# Altium project UmbilicalBoardV4.PrjPcb
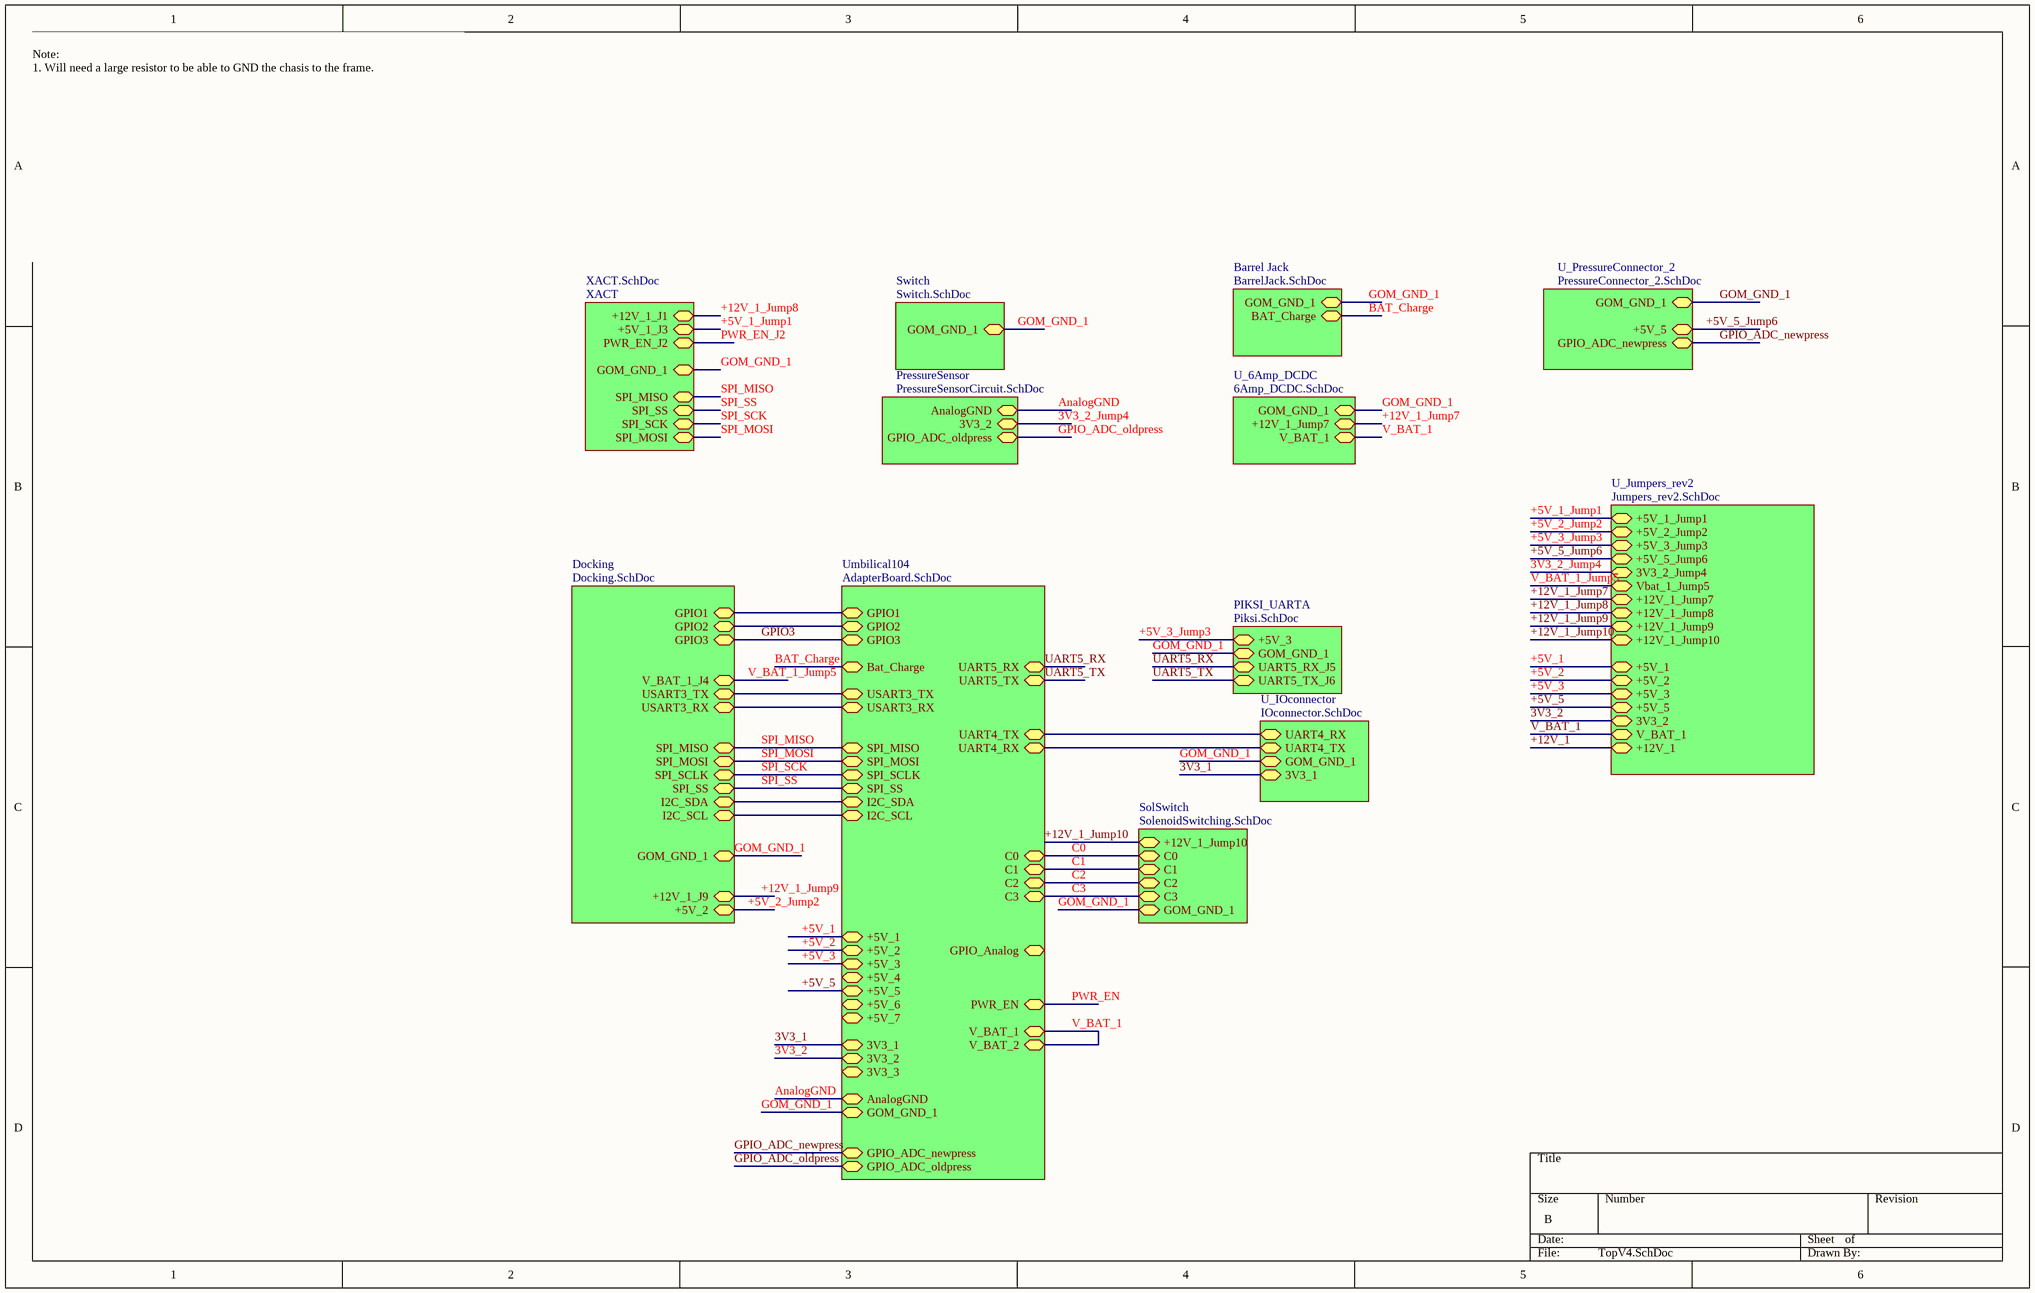
[diagram p0: TopV4.SchDoc]
2 sheets, 1 parts. Net scope: strictly hierarchical (ports join the sheet entries above them; power ports are local).
Board files: UmbilicalBoardV4.PcbDoc, 2016-05-17_12-43-15.PcbDoc
Sheets:
  TopV4.SchDoc
    PIKSI_UARTA = Piksi.SchDoc

## Sheet TopV4.SchDoc
size B; Organization: Cornell University; DocumentNumber: 1 of 11; SheetNumber: 1; SheetTotal: 11; DocumentName: Top Sheet; ProjectName: OAAN

### Sub-sheets
Barrel Jack = BarrelJack.SchDoc (file not in this document): GOM_GND_1 (bidir), BAT_Charge (bidir)
Docking = Docking.SchDoc (file not in this document): V_BAT_1_J4 (bidir), USART3_TX (bidir), SPI_SS (bidir), I2C_SDA (bidir), I2C_SCL (bidir), SPI_MOSI (bidir), SPI_SCLK (bidir), GPIO3 (bidir), +5V_2 (bidir), USART3_RX (bidir), SPI_MISO (bidir), GPIO2 (bidir), +12V_1_J9 (bidir), GPIO1 (bidir), GOM_GND_1 (bidir)
PIKSI_UARTA = Piksi.SchDoc: UART5_RX_J5 (bidir), UART5_TX_J6 (bidir), GOM_GND_1 (bidir), +5V_3 (bidir)
PressureSensor = PressureSensorCircuit.SchDoc (file not in this document): GPIO_ADC_oldpress (bidir), 3V3_2 (bidir), AnalogGND (bidir)
SolSwitch = SolenoidSwitching.SchDoc (file not in this document): C3 (bidir), C2 (bidir), +12V_1_Jump10 (bidir), C1 (bidir), C0 (bidir), GOM_GND_1 (bidir)
Switch = Switch.SchDoc (file not in this document): GOM_GND_1 (bidir)
U_6Amp_DCDC = 6Amp_DCDC.SchDoc (file not in this document): GOM_GND_1 (bidir), +12V_1_Jump7 (bidir), V_BAT_1 (bidir)
U_IOconnector = IOconnector.SchDoc (file not in this document): UART4_RX (bidir), UART4_TX (bidir), GOM_GND_1 (bidir), 3V3_1 (bidir)
U_Jumpers_rev2 = Jumpers_rev2.SchDoc (file not in this document): +5V_1_Jump1 (bidir), +5V_2_Jump2 (bidir), +5V_3_Jump3 (bidir), 3V3_2_Jump4 (bidir), Vbat_1_Jump5 (bidir), +5V_1 (bidir), +5V_2 (bidir), 3V3_2 (bidir), V_BAT_1 (bidir), +5V_3 (bidir), +5V_5_Jump6 (bidir), +5V_5 (bidir), +12V_1_Jump7 (bidir), +12V_1 (bidir), +12V_1_Jump9 (bidir), +12V_1_Jump8 (bidir), +12V_1_Jump10 (bidir)
U_PressureConnector_2 = PressureConnector_2.SchDoc (file not in this document): GOM_GND_1 (bidir), +5V_5 (bidir), GPIO_ADC_newpress (bidir)
Umbilical104 = AdapterBoard.SchDoc (file not in this document): C0 (bidir), 3V3_1 (bidir), USART3_TX (bidir), USART3_RX (bidir), GPIO3 (bidir), GPIO2 (bidir), GPIO1 (bidir), Bat_Charge (bidir), V_BAT_1 (bidir), I2C_SCL (bidir), SPI_MOSI (bidir), +5V_1 (bidir), I2C_SDA (bidir), SPI_MISO (bidir), SPI_SCLK (bidir), SPI_SS (bidir), UART5_RX (bidir), UART5_TX (bidir), UART4_TX (bidir), UART4_RX (bidir), C3 (bidir), C1 (bidir), C2 (bidir), +5V_3 (bidir), +5V_6 (bidir), +5V_5 (bidir), +5V_2 (bidir), 3V3_2 (bidir), +5V_4 (bidir), 3V3_3 (bidir), +5V_7 (bidir), GOM_GND_1 (bidir), AnalogGND (bidir), PWR_EN (bidir), V_BAT_2 (bidir), GPIO_ADC_newpress (bidir), GPIO_ADC_oldpress (bidir), GPIO_Analog (bidir)
XACT = XACT.SchDoc (file not in this document): +12V_1_J1 (bidir), +5V_1_J3 (bidir), SPI_SCK (bidir), SPI_SS (bidir), GOM_GND_1 (bidir), SPI_MOSI (bidir), SPI_MISO (bidir), PWR_EN_J2 (bidir)

### Nets
3V3_1: sheet Umbilical104/3V3_1, sheet U_IOconnector/3V3_1
3V3_2: sheet Umbilical104/3V3_2, sheet U_Jumpers_rev2/3V3_2
3V3_2_Jump4: sheet PressureSensor/3V3_2, sheet U_Jumpers_rev2/3V3_2_Jump4
+5V_1: sheet Umbilical104/+5V_1, sheet U_Jumpers_rev2/+5V_1
+5V_1_Jump1: sheet XACT/+5V_1_J3, sheet U_Jumpers_rev2/+5V_1_Jump1
+5V_2: sheet Umbilical104/+5V_2, sheet U_Jumpers_rev2/+5V_2
+5V_2_Jump2: sheet Docking/+5V_2, sheet U_Jumpers_rev2/+5V_2_Jump2
+5V_3: sheet Umbilical104/+5V_3, sheet U_Jumpers_rev2/+5V_3
+5V_3_Jump3: sheet PIKSI_UARTA/+5V_3, sheet U_Jumpers_rev2/+5V_3_Jump3
+5V_5: sheet Umbilical104/+5V_5, sheet U_Jumpers_rev2/+5V_5
+5V_5_Jump6: sheet U_Jumpers_rev2/+5V_5_Jump6, sheet U_PressureConnector_2/+5V_5
+12V_1: sheet U_Jumpers_rev2/+12V_1
+12V_1_Jump7: sheet U_6Amp_DCDC/+12V_1_Jump7, sheet U_Jumpers_rev2/+12V_1_Jump7
+12V_1_Jump8: sheet XACT/+12V_1_J1, sheet U_Jumpers_rev2/+12V_1_Jump8
+12V_1_Jump9: sheet Docking/+12V_1_J9, sheet U_Jumpers_rev2/+12V_1_Jump9
+12V_1_Jump10: sheet SolSwitch/+12V_1_Jump10, sheet U_Jumpers_rev2/+12V_1_Jump10
AnalogGND: sheet Umbilical104/AnalogGND, sheet PressureSensor/AnalogGND
BAT_Charge: sheet Umbilical104/Bat_Charge, sheet Barrel Jack/BAT_Charge
C0: sheet SolSwitch/C0, sheet Umbilical104/C0
C1: sheet SolSwitch/C1, sheet Umbilical104/C1
C2: sheet SolSwitch/C2, sheet Umbilical104/C2
C3: sheet SolSwitch/C3, sheet Umbilical104/C3
GOM_GND_1: sheet SolSwitch/GOM_GND_1, sheet Umbilical104/GOM_GND_1, sheet Switch/GOM_GND_1, sheet Docking/GOM_GND_1, sheet XACT/GOM_GND_1, sheet PIKSI_UARTA/GOM_GND_1, sheet Barrel Jack/GOM_GND_1, sheet U_6Amp_DCDC/GOM_GND_1, sheet U_IOconnector/GOM_GND_1, sheet U_PressureConnector_2/GOM_GND_1
GPIO3: sheet Umbilical104/GPIO3, sheet Docking/GPIO3
GPIO_ADC_newpress: sheet Umbilical104/GPIO_ADC_newpress, sheet U_PressureConnector_2/GPIO_ADC_newpress
GPIO_ADC_oldpress: sheet Umbilical104/GPIO_ADC_oldpress, sheet PressureSensor/GPIO_ADC_oldpress
PWR_EN: sheet Umbilical104/PWR_EN
PWR_EN_J2: sheet XACT/PWR_EN_J2
SPI_MISO: sheet Umbilical104/SPI_MISO, sheet Docking/SPI_MISO, sheet XACT/SPI_MISO
SPI_MOSI: sheet Umbilical104/SPI_MOSI, sheet Docking/SPI_MOSI, sheet XACT/SPI_MOSI
SPI_SCK: sheet Umbilical104/SPI_SCLK, sheet Docking/SPI_SCLK, sheet XACT/SPI_SCK
SPI_SS: sheet Umbilical104/SPI_SS, sheet Docking/SPI_SS, sheet XACT/SPI_SS
UART5_RX: sheet Umbilical104/UART5_RX, sheet PIKSI_UARTA/UART5_RX_J5
UART5_TX: sheet Umbilical104/UART5_TX, sheet PIKSI_UARTA/UART5_TX_J6
V_BAT_1: sheet Umbilical104/V_BAT_1, sheet Umbilical104/V_BAT_2, sheet U_6Amp_DCDC/V_BAT_1, sheet U_Jumpers_rev2/V_BAT_1
V_BAT_1_Jump5: sheet Docking/V_BAT_1_J4, sheet U_Jumpers_rev2/Vbat_1_Jump5
(unnamed): sheet Umbilical104/USART3_TX, sheet Docking/USART3_TX
(unnamed): sheet Umbilical104/USART3_RX, sheet Docking/USART3_RX
(unnamed): sheet Umbilical104/GPIO2, sheet Docking/GPIO2
(unnamed): sheet Umbilical104/GPIO1, sheet Docking/GPIO1
(unnamed): sheet Umbilical104/I2C_SCL, sheet Docking/I2C_SCL
(unnamed): sheet Umbilical104/I2C_SDA, sheet Docking/I2C_SDA
(unnamed): sheet Umbilical104/UART4_TX, sheet U_IOconnector/UART4_RX
(unnamed): sheet Umbilical104/UART4_RX, sheet U_IOconnector/UART4_TX

### Notes on the sheet
- Note:
  1. Will need a large resistor to be able to GND the chasis to the frame.

## Sheet Piksi.SchDoc
size B
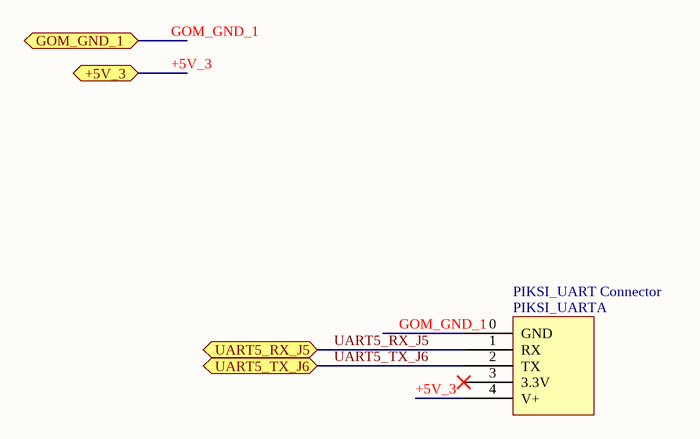
[diagram p1: Piksi.SchDoc]

### Parts
PIKSI_UARTA  PIKSI_UART Connector  [Molex Picoblade 5 Pin]

### Ports
+5V_3 (bidir), GOM_GND_1 (bidir), UART5_RX_J5 (bidir), UART5_TX_J6 (bidir)

### Nets
+5V_3: PIKSI_UARTA.4(V+) ; port +5V_3  [project net +5V_3_Jump3]
GOM_GND_1: PIKSI_UARTA.0(GND) ; port GOM_GND_1
UART5_RX_J5: PIKSI_UARTA.1(RX) ; port UART5_RX_J5  [project net UART5_RX]
UART5_TX_J6: PIKSI_UARTA.2(TX) ; port UART5_TX_J6  [project net UART5_TX]

Not connected (* = marked no-connect by the designer): PIKSI_UARTA 3(3.3V)*

### Library data of the parts
PIKSI_UARTA = PIKSI_UART Connector: Molex Picoblade 5 Pin